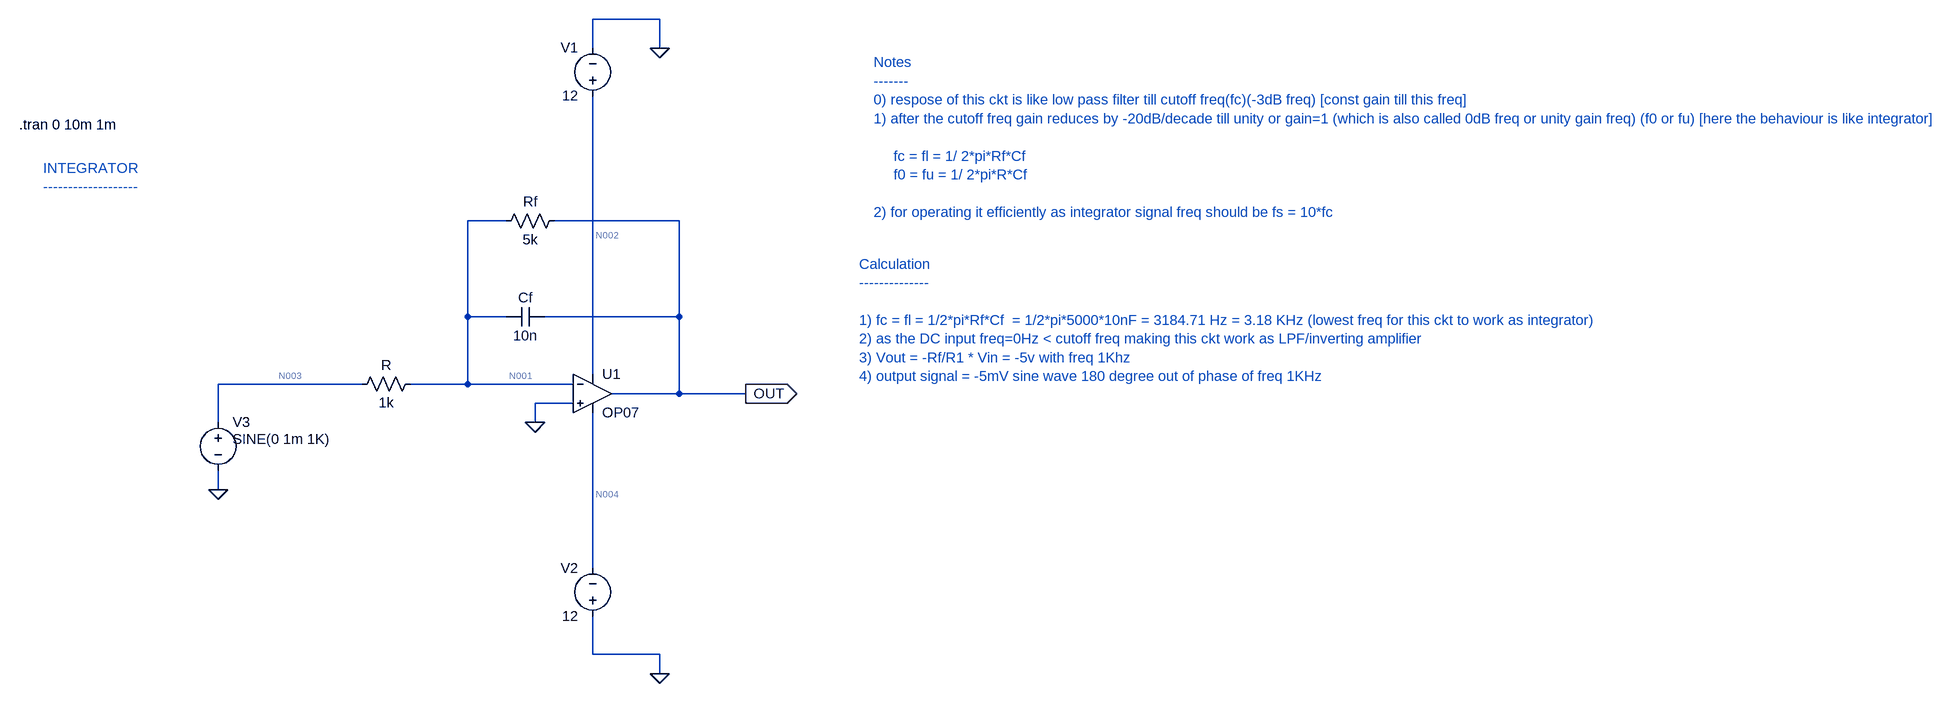
[diagram p0: schematic Op_amp_as_INTEGRATOR_with_AC_input_with_freq_less_than_cutoff_freq.asc]
Op_amp_as_INTEGRATOR_with_AC_input_with_freq_less_than_cutoff_freq.asc, the LTspice schematic file:
Version 4.1
SHEET 1 3496 1680
WIRE 192 -544 80 -544
WIRE 80 -496 80 -544
WIRE 192 -496 192 -544
WIRE -64 -208 -128 -208
WIRE 224 -208 16 -208
WIRE -128 -48 -128 -208
WIRE -64 -48 -128 -48
WIRE 224 -48 224 -208
WIRE 224 -48 0 -48
WIRE 80 48 80 -416
WIRE -304 64 -544 64
WIRE -128 64 -128 -48
WIRE -128 64 -224 64
WIRE 48 64 -128 64
WIRE 224 80 224 -48
WIRE 224 80 112 80
WIRE 352 80 224 80
WIRE 48 96 -16 96
WIRE -544 128 -544 64
WIRE -16 128 -16 96
WIRE -544 240 -544 208
WIRE 80 384 80 112
WIRE 80 528 80 464
WIRE 192 528 80 528
WIRE 192 560 192 528
FLAG 192 -496 0
FLAG 192 560 0
FLAG -544 240 0
FLAG 352 80 OUT
IOPIN 352 80 Out
FLAG -16 128 0
SYMBOL voltage 80 -400 R180
WINDOW 0 24 96 Left 2
WINDOW 3 24 16 Left 2
WINDOW 123 0 0 Left 0
WINDOW 39 0 0 Left 0
SYMATTR InstName V1
SYMATTR Value 12
SYMBOL voltage 80 480 R180
WINDOW 0 24 96 Left 2
WINDOW 3 24 16 Left 2
WINDOW 123 0 0 Left 0
WINDOW 39 0 0 Left 0
SYMATTR InstName V2
SYMATTR Value 12
SYMBOL OpAmps\\OP07 80 16 R0
SYMATTR InstName U1
SYMBOL res -208 48 R90
WINDOW 0 0 56 VBottom 2
WINDOW 3 32 56 VTop 2
SYMATTR InstName R
SYMATTR Value 1k
SYMBOL voltage -544 112 R0
WINDOW 123 0 0 Left 0
WINDOW 39 0 0 Left 0
WINDOW 3 24 44 Left 2
SYMATTR Value SINE(0 1m 1K)
SYMATTR InstName V3
SYMBOL cap 0 -64 R90
WINDOW 0 0 32 VBottom 2
WINDOW 3 32 32 VTop 2
SYMATTR InstName Cf
SYMATTR Value 10n
SYMBOL res 32 -224 R90
WINDOW 0 0 56 VBottom 2
WINDOW 3 32 56 VTop 2
SYMATTR InstName Rf
SYMATTR Value 5k
TEXT -1264 -368 Left 2 !.tran 0 10m 1m
TEXT -1224 -296 Left 2 ;INTEGRATOR\n-------------------
TEXT 1072 -472 Left 2 ;Notes\n-------\n0) respose of this ckt is like low pass filter till cutoff freq(fc)(-3dB freq) [const gain till this freq]\n1) after the cutoff freq gain reduces by -20dB/decade till unity or gain=1 (which is also called 0dB freq or unity gain freq) (f0 or fu) [here the behaviour is like integrator]\n     \n     fc = fl = 1/ 2*pi*Rf*Cf \n     f0 = fu = 1/ 2*pi*R*Cf \n \n2) for operating it efficiently as integrator signal freq should be fs = 10*fc
TEXT 1048 -136 Left 2 ;Calculation\n--------------\n \n1) fc = fl = 1/2*pi*Rf*Cf  = 1/2*pi*5000*10nF = 3184.71 Hz = 3.18 KHz (lowest freq for this ckt to work as integrator)\n2) as the DC input freq=0Hz < cutoff freq making this ckt work as LPF/inverting amplifier\n3) Vout = -Rf/R1 * Vin = -5v with freq 1Khz\n4) output signal = -5mV sine wave 180 degree out of phase of freq 1KHz

The netlist it stands for:
* Op_amp_as_INTEGRATOR_with_AC_input_with_freq_less_than_cutoff_freq.asc
V1 N002 0 12
V2 0 N004 12
X§U1 0 N001 N002 N004 OUT LT1001  ; OP07, pins In+ In- V+ V- OUT
R N001 N003 1k
V3 N003 0 SINE(0 1m 1K)
Cf OUT N001 10n
Rf OUT N001 5k
.tran 0 10m 1m
* INTEGRATOR
* -------------------
* Notes
* -------
* 0) respose of this ckt is like low pass filter till cutoff freq(fc)(-3dB freq) [const gain till this freq]
* 1) after the cutoff freq gain reduces by -20dB/decade till unity or gain=1 (which is also called 0dB freq or unity gain freq) (f0 or fu) [here the behaviour is like integrator]
*      fc = fl = 1/ 2*pi*Rf*Cf
*      f0 = fu = 1/ 2*pi*R*Cf
* 2) for operating it efficiently as integrator signal freq should be fs = 10*fc
* Calculation
* --------------
* 1) fc = fl = 1/2*pi*Rf*Cf  = 1/2*pi*5000*10nF = 3184.71 Hz = 3.18 KHz (lowest freq for this ckt to work as integrator)
* 2) as the DC input freq=0Hz < cutoff freq making this ckt work as LPF/inverting amplifier
* 3) Vout = -Rf/R1 * Vin = -5v with freq 1Khz
* 4) output signal = -5mV sine wave 180 degree out of phase of freq 1KHz
.lib LTC.lib
.backanno
.end

* Results of the author's LTspice run, read from the files saved beside the schematic
* Operating Point, zero values left out:
*   V(n004) = -12 V
*   V(n002) = 12 V
*   I(V1) = -2.25 mA
*   I(V2) = -2.25 mA
*   Ix(u1:3) = 2.25 mA
*   Ix(u1:4) = -2.25 mA
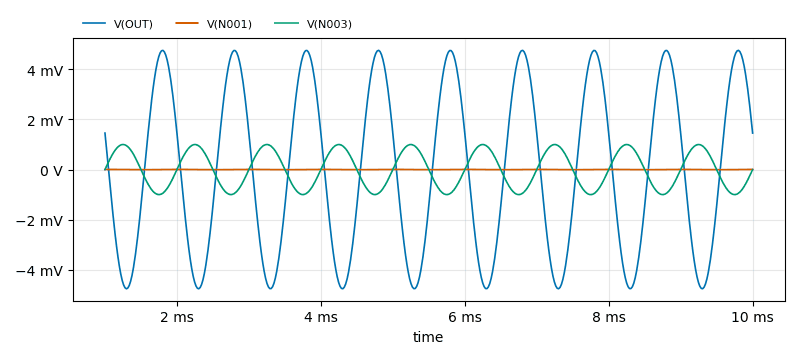
[diagram p1: Transient Analysis of Op_amp_as_INTEGRATOR_with_AC_input_with_freq_less_than_cutoff_freq.asc, plotted from the saved traces]
* Transient Analysis, 1 run:
*   V(OUT): min -4.762 mV, max 4.76 mV, average 5.471 nV, rms 3.37 mV, last 1.457 mV
*   V(N001): min -5.623 µV, max 5.623 µV, average -159.7 pV, rms 3.973 µV, last 5.357 µV
*   V(N003): min -1 mV, max 1 mV, average -9.801 nV, rms 707.8 µV, last 0 V